# EAGLE design RN4020C-1C (EAGLE 7.5.0)
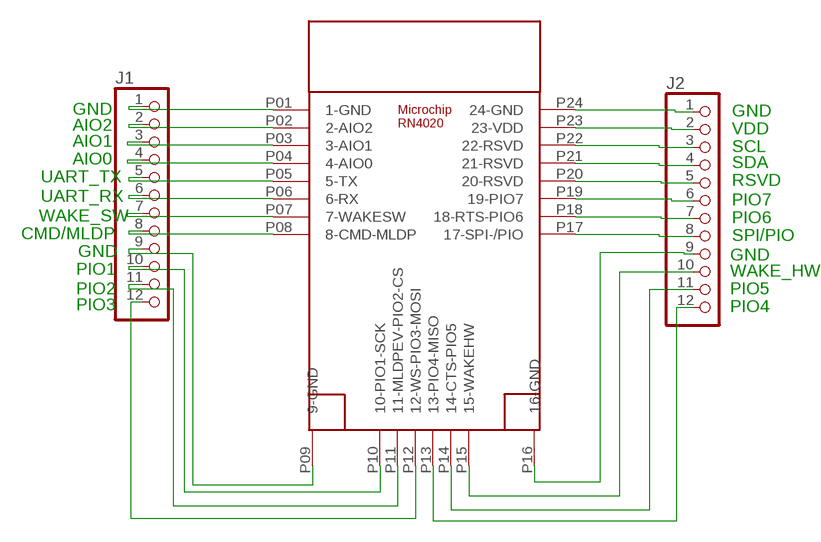
[diagram p0: schematic, sheet 1]

## Parts
J1  PINHD-1X12  [1X12]
J2  PINHD-1X12  [1X12]
U$2  RN4020  [RN4020SMD]

## Nets
N$1: J1.1 U$2.P01(1-GND)
N$2: J1.2 U$2.P02(2-AIO2)
N$3: J1.3 U$2.P03(3-AIO1)
N$4: J1.4 U$2.P04(4-AIO0)
N$5: J1.5 U$2.P05(5-TX)
N$6: J1.6 U$2.P06(6-RX)
N$7: J1.7 U$2.P07(7-WAKESW)
N$8: J1.8 U$2.P08(8-CMD-MLDP)
N$9: J2.1 U$2.P24(24-GND)
N$10: J2.2 U$2.P23(23-VDD)
N$11: J2.3 U$2.P22(22-RSVD)
N$12: J2.4 U$2.P21(21-RSVD)
N$13: J2.5 U$2.P20(20-RSVD)
N$14: J2.6 U$2.P19(19-PIO7)
N$15: J2.7 U$2.P18(18-RTS-PIO6)
N$16: J2.8 U$2.P17(17-SPI-/PIO)
N$17: J1.9 U$2.P09(9-GND)
N$18: J1.10 U$2.P10(10-PIO1-SCK)
N$19: J1.11 U$2.P11(11-MLDPEV-PIO2-CS)
N$20: J1.12 U$2.P12(12-WS-PIO3-MOSI)
N$21: J2.9 U$2.P16(16-GND)
N$22: J2.10 U$2.P15(15-WAKEHW)
N$23: J2.11 U$2.P14(14-CTS-PIO5)
N$24: J2.12 U$2.P13(13-PIO4-MISO)

## Notes on the sheet
- GND | GND
- AIO2 | VDD
- AIO1
- SCL
- AIO0 | SDA
- UART_TX | RSVD
- UART_RX | PIO7
- WAKE_SW | PIO6
- CMD/MLDP | SPI/PIO
- GND | GND
- PIO1 | WAKE_HW
- PIO2 | PIO5
- PIO3 | PIO4

## Library data of the parts
J1 J2 = pinhead:PINHD-1X12: PIN HEADER
U$2 = microchip_bluetooth_v101-cust:RN4020

## Board
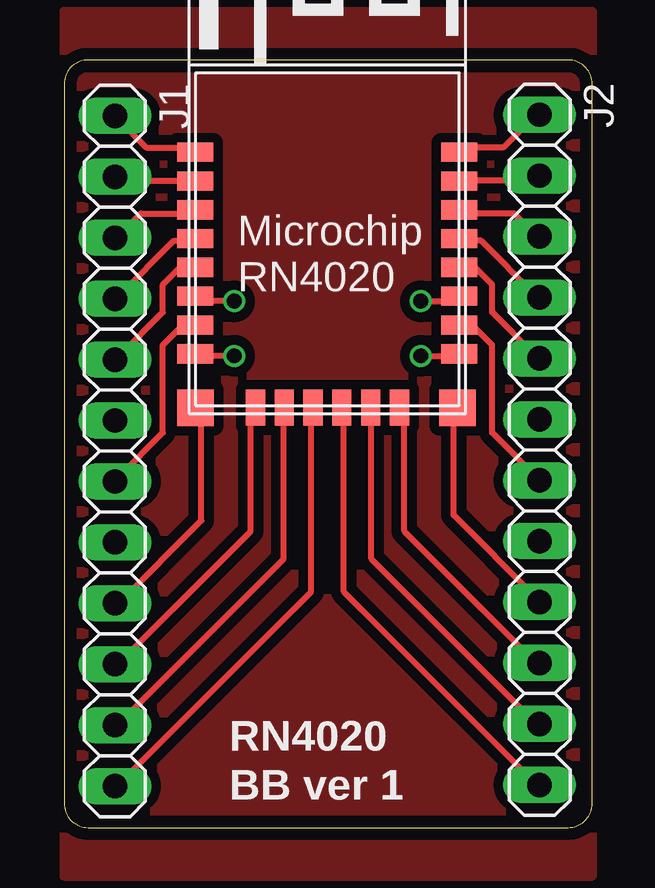
[diagram p1: board, top side]
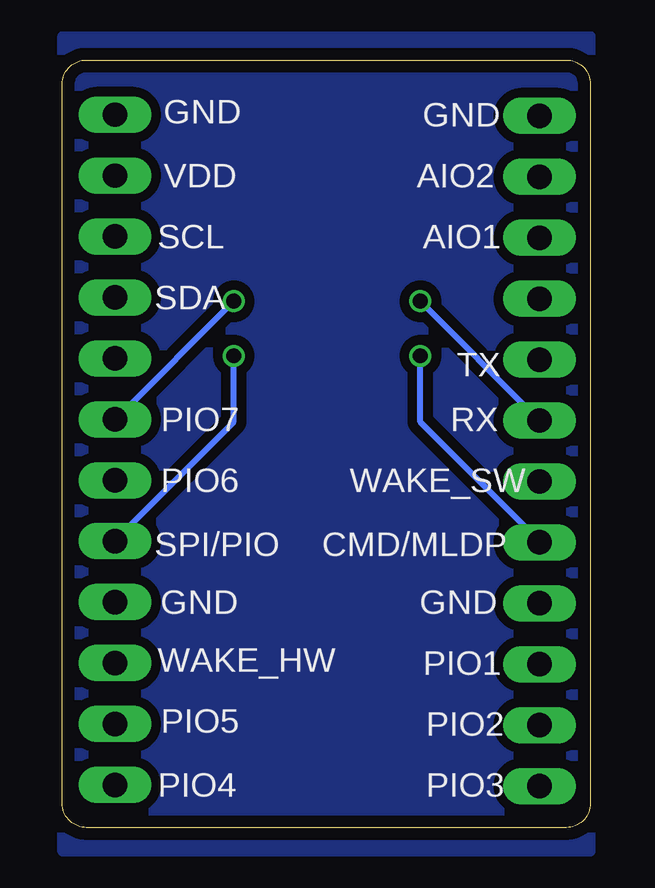
[diagram p2: board, bottom side, seen from below]

Size 22 x 32 mm. Coordinates in mm from the lower left corner, seen from the top.
Outline: 22,1 22,31 arc90 21,32 1,32 arc90 0,31 0,1 arc90 1,0 21,0 arc90 22,1
Copper layers (1*16): Top 0.035mm / dielectric 1.6mm / Bottom 0.035mm
Design rules "Elecrow_2-layer_PCB_eagle_rule": minimum track width 6mil, minimum drill 12mil, track to track 6mil, track to pad 6mil, pad to pad 6mil, via to via 8mil, smd to smd 0mil, copper to edge 20mil, drill to drill 10mil, minimum pad ring 6mil, minimum via ring 6mil, stop-mask expansion 0mil, vias tented up to drill 100mil, thermal gap 10mil

### Footprints (pad centres in the part's own frame; a part is rotated, then mirrored left to right if it is on the bottom)
1X12 = drill 1.016 long: 1 -13.97,0; 2 -11.43,0; 3 -8.89,0; 4 -6.35,0; 5 -3.81,0; 6 -1.27,0; 7 1.27,0; 8 3.81,0; 9 6.35,0; 10 8.89,0; 11 11.43,0; 12 13.97,0
RN4020SMD = smd 1.5 x 0.8: P01 0.25,10.9; P02 0.25,9.7; P03 0.25,8.5; P04 0.25,7.3; P05 0.25,6.1; P06 0.25,4.9; P07 0.25,3.7; P08 0.25,2.5; P17 11.25,2.5; P18 11.25,3.7; P19 11.25,4.9; P20 11.25,6.1; P21 11.25,7.3; P22 11.25,8.5; P23 11.25,9.7; P24 11.25,10.9 | smd 1.524 x 1.524: P09 0.254,0.254; P16 11.176,0.254 | smd 0.8 x 1.5: P10 2.75,0.25; P11 3.95,0.25; P12 5.15,0.25; P13 6.35,0.25; P14 7.55,0.25; P15 8.75,0.25

### Placement (x,y rotation side)
J1  2.11,15.7 270 top
J2  19.81,15.75 270 top
U$2  5.22,17.25 0 top

### Tracks (layer width: path | path; a pad name or v marks a point on that pad's centre or on a via)
N$1
  Top 0.254: U$2.P01 5.26,28.35 3.43,28.35 2.29,29.49 J1.1
N$2
  Top 0.254: U$2.P02 5.26,26.98 2.29,26.98 J1.2
N$3
  Top 0.254: U$2.P03 5.26,25.6 3.2,25.6 2.29,24.69 J1.3
N$4
  Top 0.254: U$2.P04 5.26,24.46 4.57,24.46 2.29,22.17 J1.4
N$5
  Top 0.254: U$2.P05 5.26,23.32 4.8,23.32 4.12,22.63 4.12,21.49 2.29,19.66 J1.5
N$6  (via drill 0.61)
  Top 0.254: v7.09,21.95 5.49,21.95 U$2.P06
  Bottom 0.254: v7.09,21.95 2.29,17.14 J1.6
N$7
  Top 0.254: U$2.P07 5.26,20.8 4.8,20.8 4.12,20.12 4.12,16.46 2.29,14.63 J1.7
N$8  (via drill 0.61)
  Top 0.254: v7.09,19.66 5.49,19.66 U$2.P08
  Bottom 0.254: v7.09,19.66 7.09,16.92 2.29,12.12 J1.8
N$9
  Top 0.254: U$2.P24 16.69,28.35 18.29,28.35 19.66,29.72 J2.1
N$10
  Top 0.254: U$2.P23 16.69,26.98 19.66,26.98 J2.2
N$11
  Top 0.254: U$2.P22 16.69,25.6 18.75,25.6 19.66,24.69 J2.3
N$12
  Top 0.254: U$2.P21 16.69,24.46 17.37,24.46 19.66,22.17 J2.4
N$13
  Top 0.254: U$2.P20 16.69,23.32 17.14,23.32 17.83,22.63 17.83,21.49 19.66,19.66 J2.5
N$14  (via drill 0.61)
  Top 0.254: v14.86,21.95 16.46,21.95 U$2.P19
  Bottom 0.254: v14.86,21.95 19.66,17.14 J2.6
N$15
  Top 0.254: J2.7 17.83,16.46 17.83,20.12 17.14,20.8 16.69,20.8 U$2.P18
N$16  (via drill 0.61)
  Top 0.254: v14.86,19.66 16.46,19.66 U$2.P17
  Bottom 0.254: v14.86,19.66 14.86,16.92 19.66,12.12 J2.8
N$17
  Top 0.254: 5.71,17.6 U$2.P09 5.71,17.27 5.71,12.8 2.29,9.37 J1.9
N$18
  Top 0.254: U$2.P10 7.77,17.37 7.77,12.34 2.29,6.86 J1.10
N$19
  Top 0.254: U$2.P11 9.14,17.37 9.14,11.2 2.29,4.34 J1.11
N$20
  Top 0.254: U$2.P12 10.29,17.37 10.29,9.83 2.29,1.83 J1.12
N$21
  Top 0.254: U$2.P16 16.23,17.6 16.23,13.03 19.66,9.6 J2.9
N$22
  Top 0.254: U$2.P15 14.17,17.37 14.17,12.34 19.66,6.86 J2.10
N$23
  Top 0.254: U$2.P14 12.8,17.37 12.8,11.2 19.66,4.34 J2.11
N$24
  Top 0.254: U$2.P13 11.66,17.37 11.66,9.83 19.66,1.83 J2.12
N$25
  pour Bottom (isolate 0.406, no thermals): 0,33 0,-1 22,-1 22,33
N$26
  pour Top (isolate 0.406, no thermals): 0,34 0,-2 22,-2 22,34

### Text on the board
tNames: RN4020 / BB ver 1
bNames: GND | GND | AIO2 | VDD | AIO1 | SCL | SDA | TX | RX | PIO7 | WAKE_SW | PIO6 | CMD/MLDP | SPI/PIO | GND | GND | PIO1 | WAKE_HW | PIO2 | PIO5 | PIO3 | PIO4